# Altium project ArduinoAutomationFarm.PrjPcb
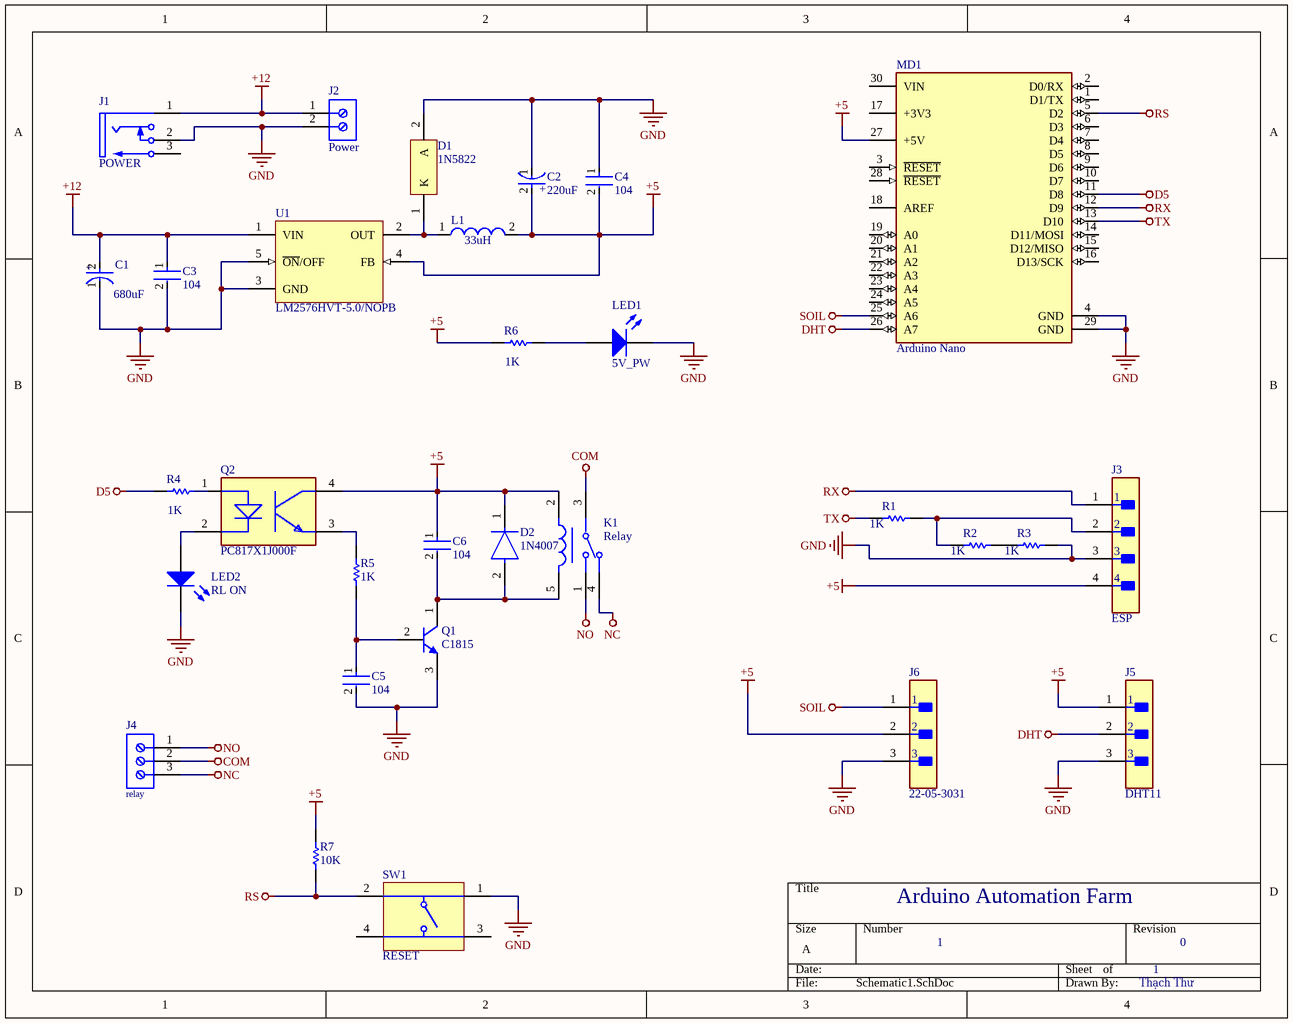
[diagram p0: Schematic1.SchDoc]
1 sheet, 30 parts. Net scope: global (net labels, ports and power ports of the same name join across sheets).
Board file: PCB.PcbDoc

## Sheet Schematic1.SchDoc
size A; SheetNumber: 1; SheetTotal: 1; SPICEModelCacheEFOLAORE: <root> / <DocumentId>EFOLAORE</DocumentId> / <CacheFrame Number="0"> / <Model Name="npn" Kind="MDL"> / <Text>*Default NPN BJT / *NPN Trans Pinout: C,B,E / .MODEL NPN NPN()</Text> / </Model> / </CacheFrame> / </root>

### Parts
C1  680uF  [FP-RAD-TH-D_12_5_0_5-L_30-MFG]
C2  220uF  [FP-RAD-TH-D_8_0_5-L_11_5-MFG]
C3  104  [FP-RCE1A2-MFG]
C4  104  [FP-RCE1A2-MFG]
C5  104  [FP-RCE1A2-MFG]
C6  104  [FP-RCE1A2-MFG]
D1  1N5822  [ONSC-AXIAL_LEAD-2-267-05_V]
D2  1N4007  [FP-1N4007-MFG]
J1  POWER  [SWITCH-RAPC712X-3_V]
J2  Power  [691102710002]
J3  ESP  [FP-110990030-MFG]
J4  relay  [691101710003]
J5  DHT11  [FP-22-28-4030-MFG]
J6  22-05-3031  [FP-22-05-3031-MFG]
K1  Relay  [FP-1-1721150-0-MFG]
L1  33uH  [WE-TI-L]
LED1  5V_PW  [Type 5mm]
LED2  RL ON  [Type 5mm]
MD1  Arduino Nano  [FP-A000005-MFG]
Q1  C1815  [TO-226-AA]
Q2  PC817X1J000F  [FP-PC817X1J000F-MFG]
R1  value 1K  [AXIAL-0.3]  (hidden comment: Res1)
R2  value 1K  [AXIAL-0.3]  (hidden comment: Res1)
R3  value 1K  [AXIAL-0.3]  (hidden comment: Res1)
R4  value 1K  [AXIAL-0.3]  (hidden comment: Res1)
R5  value 1K  [AXIAL-0.3]  (hidden comment: Res1)
R6  value 1K  [AXIAL-0.3]  (hidden comment: Res1)
R7  value 10K  [AXIAL-0.3]
SW1  RESET  [TECO-1825910-6_V]
U1  LM2576HVT-5.0/NOPB  [KC0005A]

### Nets
+5: C2.2(A) C4.2 C6.1 D2.1(C) J3.4 J5.1 J6.2 K1.2 L1.2 MD1.27(+5V) Q2.4(C) R6.2 R7.1 U1.4(FB)
+12: C1.2(A) C3.1 J1.1 J2.1 U1.1(VIN)
COM: J4.2 K1.3
D5: MD1.11(D8) R4.2
DHT: J5.2 MD1.26(A7)
GND: C1.1(C) C2.1(C) C3.2 C4.1 C5.2 D1.2(A) J1.2 J2.2 J3.3 J5.3 J6.3 LED1.1(K) LED2.1(K) MD1.4(GND) MD1.29(GND) Q1.3(E) R3.1 SW1.1 U1.3(GND) U1.5(~{ON}/OFF)
NC: J4.3 K1.4
NO: J4.1 K1.1
RS: MD1.5(D2) R7.2 SW1.2
RX: J3.1 MD1.12(D9)
SOIL: J6.1 MD1.25(A6)
TX: MD1.13(D10) R1.2
NetC5_1: C5.1 Q1.2(B) R5.2
NetC6_2: C6.2 D2.2(A) K1.5 Q1.1(C)
NetD1_1: D1.1(K) L1.1 U1.2(OUT)
NetJ3_2: J3.2 R1.1 R2.2
NetLED1_2: LED1.2(A) R6.1
NetLED2_2: LED2.2(A) Q2.2(C)
NetQ2_1: Q2.1(A) R4.1
NetQ2_3: Q2.3(E) R5.1
NetR2_1: R2.1 R3.2

Not connected (* = marked no-connect by the designer): J1 3; MD1 1(D1/TX) 2(D0/RX) 3(~{RESET}) 6(D3) 7(D4) 8(D5) 9(D6) 10(D7) 14(D11/MOSI) 15(D12/MISO) 16(D13/SCK) 17(+3V3) 18(AREF) 19(A0) 20(A1) 21(A2) 22(A3) 23(A4) 24(A5) 28(~{RESET}) 30(VIN); SW1 3 4

### Notes on the sheet
- Arduino Automation Farm
- 1
- 0
- Thạch Thư
- (in symbol CMP-05427-000847-1) +
- (in symbol CMP-05427-002075-1) +

### Library data of the parts
C1 = CMP-05427-002075-1: Aluminum Electrolytic Capacitors (Radial Lead Type) AEC-Q200 Qualified 680uF ±20% 50V; ESR (Equivalent Series Resistance): 40mR; Material: Aluminium; Ripple Current: 2.215A; Lead Diameter: 0.8mm; Leakage Current: 3uA; Life (Hours): 5000Hour; Height: 30mm; Width: 12.5mm; Max Operating Temperature: 105°C; Length: 30mm; Capacitance: 680uF; Number of Pins: 2; Construction: RADIAL; Min Operating Temperature: -55°C; Height - Seated (Max): 1.181inch; Packaging: Bulk; Voltage: 50V; Series: FC; REACH SVHC: No SVHC; RoHS Compliant: Yes; Voltage Rating: 50V; Package Quantity: 100; Radiation Hardening: No; Ratings: AEC-Q200; Lead Pitch: 5mm; Voltage Rating (DC): 50V; Tolerance: 20%; Mount: Through Hole; Case/Package: Radial; Diameter: 12.5mm; Termination: Radial; Impedance: 40mR; Ripple Current (AC): 2.215A; Lead Free: Lead Free
C2 = CMP-05427-000847-1: Aluminum Electrolytic Capacitors (Radial Lead Type) 220uF ±20% 25V; Impedance: 56mR; Ripple Current (AC): 950mA; Lead Diameter: 0.6mm; Life (Hours): 6000Hour; Max Operating Temperature: 105°C; Height: 11.5mm; Min Operating Temperature: -40°C; Series: FR Radial; Voltage Rating (DC): 25V; RoHS Compliant: Yes; Voltage Rating: 25V; Diameter: 8mm; Ripple Current: 950mA; Contact Plating: Tin; Case/Package: Radial; Lead Pitch: 3.5mm; Termination: Radial; Capacitance: 220uF; Construction: RADIAL; Voltage: 25V; Tolerance: 20%; REACH SVHC: Yes; Mount: Through Hole
C3-C6 = CMP-06035-052488-1: Cap Ceramic 100nF 100V X7R ±10% Radial 2.5mm +125°C Automotive Ammo Pack; Lead/Base Style: Straight; Lead Diameter: 0.5mm; Termination: Radial; Height: 3.5mm; Capacitance: 100nF; Ratings: AEC-Q200; Max Operating Temperature: 125°C; Min Operating Temperature: -55°C; Case/Package: Radial; Package Quantity: 2000; Resistor Type: Ceramic; Mount: Through Hole; Dielectric: X7R; Lead Free: Lead Free; Height - Seated (Max): 0.138inch; Width: 0.098inch; Tolerance: 10%; Packaging: Tape and Reel; Lead Pitch: 0.098inch; Length: 0.157inch; Voltage Rating: 100V; Voltage Rating (DC): 100V
D1 = CMP-1055-00007-1: Rectifier, 2-Pin Axial_Lead, Bulk Bag; Manufacturer: On Semiconductor; IFSM Max (A): 80; Note1: 0; Configuration: Single; PartNumber: 1N5822; ComponentLink2Description: Datasheet; RoHS: FALSE; PackageDescription: 2-Pin, Axial Lead, Diameter 5.05 mm; Mounting Technology: Through Hole; PackageReference: AXIAL_LEAD-2-267-05; ComponentLink1URL: http://www.onsemi.com/; PackageVersion: Rev. G, 06/2000; ComponentLink2URL: http://www.onsemi.cn/pub_link/Collateral/1N5820-D.PDF; ComponentLink3Description: Package Specification; ComponentLink1Description: Manufacturer URL; ComponentLink3URL: http://www.onsemi.com/pub_link/Collateral/267-05.PDF; Packing: Bulk Bag; DatasheetVersion: Rev. 10
D2 = CMP-123542-000001-1: Rectifier diode 1000 V 1 A DO-41, ,; Manufacturer: Diotec; Max Surge Forward Current: 27A; Forward Current: 1A; Max Junction Temp: +175°C; Reverse Voltage: 1000V; Value: 15pF; Peak Reverse Current: 5uA; Category: Diode; Temperature Range Low: -50°C; Automotive: No; Temperature: -50°C to +175°C; Lead Free: Yes; ComponentLink2Description: Datasheet; Max Repetitive Reverse Voltage: 1000V; ComponentLink2URL: https://datasheet.octopart.com/1N4007-Diotec-datasheet-62346875.pdf; Manufacturer Part Number: 1N4007; Device Class L3: Rectifier Diodes; Height: 2.8mm; Octopart: https://octopart.com/1n4007-diotec-4040411; Package: 1N4007; Temperature Range High: +175°C; Device Class L1: Discrete Semiconductors; Device Class L2: Diodes; RoHS: TRUE; Capacitance: 15pF; Ipc Land Pattern Name: DIOAD888W100L520D280
J1 = CMP-2000-05383-1: Conn Powerjack Mini R/A PCMT, 5 A, 3-Pin THD, RoHS; Manufacturer: Switchcraft; Gender: Male; Current Rating: 5A; Connector Type: Jack; Dynamic Catalog: SwitchcraftInc; Other Names: Q2387461 / Q2526383 / RAPC712X-ND / SC237; Internal Switch(s): SingleSwitch,NormallyClosed; Catalog Drawings: RAPC7(1,2)2XSide / RAPC7(1,2)2XTop; Plug/Mating Plug Diameter: 2.5mmID,5.5mmOD; Number of Positions/Contacts: 2Conductors,2Contacts; Shielding: Unshielded; Mating Products: SC1539-ND / -CONNPLUGMINIPWR2CONDBLK/RED / SC1051-ND / -CONNPLUGMINIPOWER2CONDBLACK; Mounting Type: ThroughHole,RightAngle; Manufacturer URL: http://www.switchcraft.com/; Contact Material: Brass; Standard Package: 2,500; RoHS Information: SwitchcraftRoHSInfo; Termination: SolderEyelet(s); Housing Color: Black; Datasheet Version: Rev. A, 08/2005; Family: Barrel-PowerConnectors; Housing Material: Thermoplastic; Color: Black; Datasheet URL: https://datasheet.ciiva.com/391/rapc712x-cd-391666.pdf; Category: Connectors,Interconnects; Contact Material - Plating: Nickel
J2 = CMP-1502-03258-1: Series 102 - 5.00 mm Horizontal Entry Modular with Pressure Clamp WR-TBL, 2 pin; Manufacturer: Wurth Elektronik; Pin Number: 2; Pitch: 5.00mm; Manufacturer URL: http://www.we-online.de; Mounting Technology: THT; Publisher: WurthElektronik; Packaging: Box; Package Reference: 691102710002; Datasheet URL: http://katalog.we-online.de/em/datasheet/6911027100xx.pdf; Operating Temperature: -40to105degC; Part Number: 691102710002
J3 = CMP-139044-000001-1: GROVE 2MM 4PIN VERT CONN 10PCS; Series: -
J4 = CMP-1502-03257-1: Series 101 - 5.00 mm Horizontal Entry Modular with Pressure Clamp WR-TBL, 3 pin; Manufacturer: Wurth Elektronik; Pitch: 5.00mm; Pin Number: 3; Publisher: WurthElektronik; Part Number: 691101710003; Operating Temperature: -40to105degC; Package Reference: 691101710003; Packaging: Box; Manufacturer URL: http://www.we-online.de; Datasheet URL: http://katalog.we-online.de/em/datasheet/6911017100xx.pdf; Mounting Technology: THT
J5 = CMP-04776-000098-1: CONN HEADER VERT 3POS 2.54MM; Manufacturer: Molex; Conn Orientation: Vertical; Conn Gender: Male; Current Rating: 4A; Voltage Rating: 500V; Number Of Contacts: 3; Category: Conn; Number Of Rows: 1; Manufacturer Part Number: 22-28-4030; RoHS: TRUE; Package: 22-28-4030; Footprint Url: https://www.molex.com/pdm_docs/sd/022284030_sd.pdf; ComponentLink2Description: Datasheet; Device Class L2: Headers and Wire Housings; Automotive: No; Temperature Range Low: -40°C; Digikey Description: CONN HEADER VERT 3POS 2.54MM; Mouser Description: Headers & Wire Housings 3P VERT HEADER Sn; Contact Material: Gold,Nickel; Pitch: 2.54mm; Device Class L1: Connectors; Lead Free: Yes; Device Class L3: unset; Temperature Range High: +80°C; Octopart: https://octopart.com/0022284030-molex-10476094; ComponentLink2URL: https://www.molex.com/webdocs/datasheets/pdf/en-us/0022284030_PCB_HEADERS.pdf; Height: 8.88mm; Temperature: -40°C to +80°C
J6 = CMP-04776-000253-1: CONN HEADER R/A 3POS 2.54MM; Number of Positions: 3; Max Current Rating: 4A; Contact Resistance: 10mR; Voltage Rating (DC): 250V; Gender: Male; Approvals: UL; Insulation Resistance: 50GR; Glow Wire Compliant: Non-compliant; Contact Plating: Tin; Packaging: Bulk; Color: White; Series: 7478; Package Quantity: 2000; Depth: 12.83mm; Mount: Through Hole; Length: 7.62mm; Fastening Type: Friction; Number of Circuits: 3; Lead Pitch: 2.54mm; Housing Color: White; Contact Type: Male Pin; Lead Free: Lead Free; Flammability Rating: UL94 V-0; Halogen Free: Low Halogen; Termination: Solder; Contact Mating Length: 0.264inch; Radiation Hardening: No; Min Operating Temperature: 0°C; Pitch: 2.54mm; RoHS Compliant: Yes; Orientation: Right Angle; Number of Rows: 1; Height: 6.35mm; Max Operating Temperature: 75°C; Voltage Rating: 250V; Contact Material: Brass; Number of Contacts: 3; Housing Material: Nylon; Current Rating: 4A
K1 = CMP-03395-000112-1: RELAY GEN PURPOSE SPDT 10A 5V; Manufacturer: TE; Manufacturer Part Number: 1-1721150-0; Coil Power: 360mW; Coil Resistance: 70Ω; Coil Type: Non-Latching; Number Of Contacts: 1; Standoff Height: 0.2mm; Device Class L1: Electromechanical; Device Class L3: Power Relays; Throw Configuration: SPDT; ComponentLink2Description: Datasheet; RoHS: TRUE; Automotive: No; Octopart: https://octopart.com/1-1721150-0-te+connectivity-41294869; Switching Current: 10A; Ambient Temperature Range Low: -30°C; ComponentLink2URL: https://www.te.com/usa-en/product-1-1721150-0.html?te_bu=Cor&te_type=other&te_campaign=oct_glo_cor-oct-global-oth-prtnr-fy19-oct-octo-buy-bom_sma-298_2&elqCampaignId=35216; Package: 1-1721150-0; Height: 16.3mm; Lead Free: Yes; Digikey Description: RELAY GEN PURPOSE SPDT 10A 5V; Category: Relay; Ambient Temperature Range High: +70°C; Device Class L2: Relays; Current Rating: 10A; Coil Voltage: 5V
L1 = CMP-1405-00029-1: Radial Leaded Wire Wound Inductor WE-TI, L=330 µH; PartNumber: 744772331; Manufacturer: Wuerth Elektronik; Inductance: 330 ÂµH; PackageDescription: THT Inductor, 2-Leads, Body 7.8 x 7.8 mm; PackageReference: WE-TI-L; ComponentLink1Description: Manufacturer URL; ComponentLink2URL: http://www.we-online.de/katalog/media/pdf/744772331.pdf; ComponentLink1URL: http://www.we-online.com; ComponentLink2Description: Datasheet
LED1 LED2 = CMP-1488-00009-1: THT LED round mono-color color lens, WL-TMRW, Blue; Manufacturer: Wuerth Elektronik; PartNumber: 151051BS04000; PackageReference: Type 5mm; ComponentLink2Description: Datasheet; ComponentLink1Description: Manufacturer URL; Emitting color: Blue; ComponentLink1URL: http://www.we-online.com; ComponentLink2URL: http://katalog.we-online.de/pbs/datasheet/7448042001.pdfhttp://katalog.we-online.de/pbs/datasheet/7448042001.pdfhttp://katalog.we-online.de/pbs/datasheet/7448042001.pdfhttp://katalog.we-online.de/pbs/datasheet/151051BS04000.pdf
MD1 = CMP-189986-000002-1: ARDUINO NANO ATMEGA328 EVAL BRD; Number of Bits: 8; Evaluation Kit: Yes; Operating Supply Voltage: 12V; Interface: I2C; Data Bus Width: 8b; Core Architecture: AVR; Packaging: Bulk; Length: 7inch; Package Quantity: 50; Width: 5inch; REACH SVHC: No SVHC; Weight: 0.358383oz; Series: AVR® ATmega; Height: 0.25inch
Q1 = NPN: NPN Bipolar Transistor; pin to pad: 1>2 2>3 3>1; Published: 8-Jun-2000; LatestRevisionDate: 17-Jul-2002; LatestRevisionNote: Re-released for DXP Platform.; PackageReference: TO-226-AA; Publisher: Altium Limited; PackageDescription: TO, Flat Index; 3 In-Line, Axial Leads; Body Dia. 4.8mm; Leads 0.55 x 0.51 mm (max); Code_JEDEC: TO-226-AA
Q2 = CMP-65434-000003-1: OPTOISOLATOR 5KV TRANS 4DIP; Collector Emitter Saturation Voltage: 200mV; Forward Voltage: 1.4V; Power Dissipation: 200mW; Input Current: 20mA; Max Collector Current: 50mA; Collector Emitter Breakdown Voltage: 80V; Rise Time: 18000ns; Number of Elements: 1; Reverse Breakdown Voltage: 6V; Current Transfer Ratio: 600%; Min Operating Temperature: -30°C; Number of Pins: 4; Radiation Hardening: No; Output Current per Channel: 50mA; Case/Package: DIP; Fall Time: 18000ns; Forward Current: 50mA; Isolation Voltage: 5kV; Package Quantity: 2000; Max Operating Temperature: 100°C; Packaging: Sleeve; Max Input Current: 50mA; Output Voltage: 80V; Max Power Dissipation: 200mW; Mount: Through Hole; Number of Channels: 1; Collector Emitter Voltage (VCEO): 80V
R1-R7 = Res1: Resistor; Published: 8-Jun-2000; LatestRevisionDate: 17-Jul-2002; LatestRevisionNote: Re-released for DXP Platform.; PackageReference: AXIAL-0.3; Publisher: Altium Limited; PackageDescription: Axial Device, Thru-Hole; 2 Leads; 0.3 in Pin Spacing
SW1 = CMP-1684-00021-1: Tact Switch, SPST-NO, 0.05 A, -35 to 85 degC, 4-Pin THD, RoHS, Bulk; Part No: 1825910-6; Manufacturer: TE Connectivity; Maximum Contact Resistance: 100mOhm; Mechanical Life: 100000Cycles; Bushing Type: Unthreaded; Switch Configuration: OFF(ON); Maximum DC Voltage Rating: 24V; Contact Rating @ Voltage: 0.05A@24VDC; Actuator Color: Black; Body Orientation: Straight; Function: MomentaryContact; Illumination: N/R; Actuator Style: RoundButton; Actuator Material: PolybutyleneTerephthalate; Dielectric Strength: 500VAC; Pole Throw Configuration: SPST; Actuator Length: 1.4mm; Product Weight: N/A; Contact Material: CopperAlloy; Housing Material: N/A; Terminal Type: PCPins; Minimum Insulation Resistance: 100MOhm; Package Description: 4-Pin Through Hole Device, Body 5.99 x 5.99 mm, Pitch 6.5 mm; Package Reference: THD; Base Material: N/A; Manufacturer URL: http://www.te.com; Contact Plating: Silver; RoHS: Yes; Datasheet Version: Rev. C9; Electrical Life: 100000Cycles; Maximum AC Voltage Rating: N/A; Thread Size: N/R; Operating Temperature: -35to85C; Mounting: ThroughHole; Dimension: 5.99x5mm; Datasheet URL: http://www.te.com/commerce/DocumentDelivery/DDEController?Action=showdoc&DocId=Customer+Drawing%7F1825910%7FC9%7Fpdf%7FEnglish%7FENG_CD_1825910_C9.pdf%7F1825910-6; Family: 1825910; Seal Location: N/A; Seal Description: N/A; Packaging: N/A
U1 = CMP-0069-01992-3: SIMPLE SWITCHER® 3A Step-Down Voltage Regulator, 5-pin TO-220, Pb-Free; Manufacturer: Texas Instruments; PowerWise: N; PackageTopMarking: NSUZXYTTE#*LM2576HVT*-5.0 P+; Code_JEDEC: TO-220-AB; PackageReference: KC0005A; CompType: Switcher; PinCount: 5; RoHS: Y; PackageDescription: TO-220, Molded, 5 Lead, Straight; ComponentLink1URL: http://www.ti.com/general/docs/lit/getliterature.tsp?genericPartNumber=LM2576HV&fileType=pdf; ComponentLink1Description: Datasheet URL